# Altium project Smart Dustbin.PrjPcb
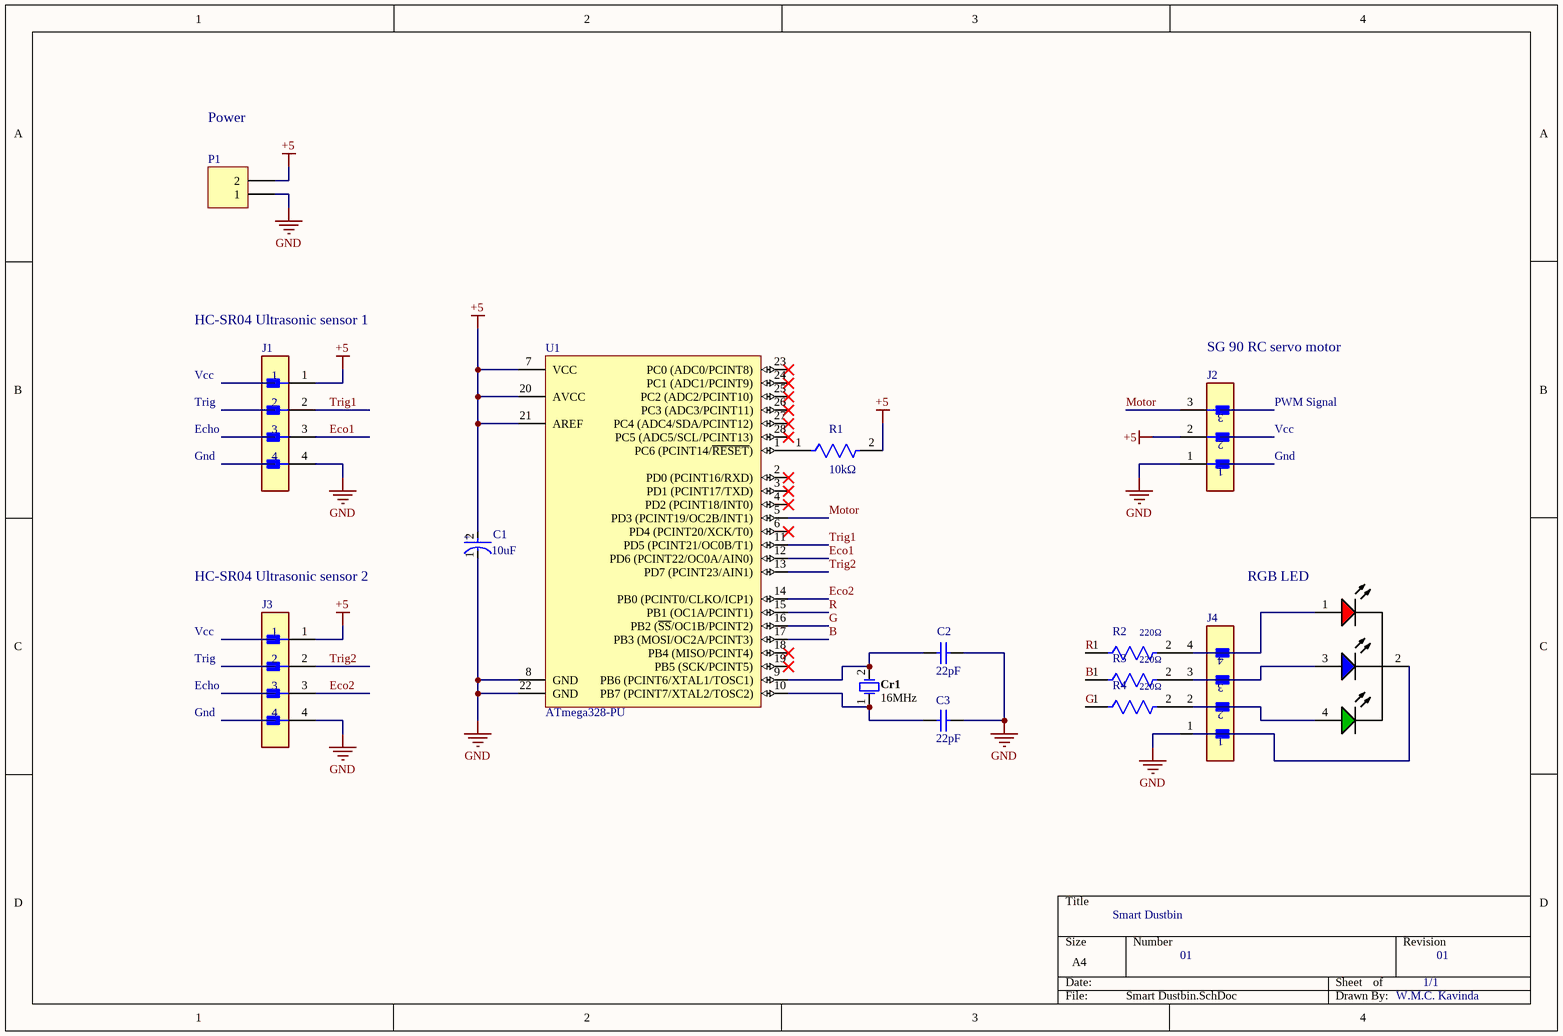
[diagram p0: Smart Dustbin.SchDoc]
1 sheet, 15 parts. Net scope: global (net labels, ports and power ports of the same name join across sheets).
Board file: Smart Dustbin.PcbDoc

## Sheet Smart Dustbin.SchDoc
size A4; SheetNumber: 1; SheetTotal: 1

### Parts
C1  10uF  [FP-RAD-TH-D_8_0_5-L_11_5-MFG]
C2  22pF  [KEMT-C315-THT-2]
C3  22pF  [KEMT-C315-THT-2]
Cr1  16MHz  [FOX-FOXSLF160-20]
DS1  WP154A4SUREQBFZGC  [KING-WP154A4SUREQBFZGC_V]  (value not drawn)
J1  TMM-104-01-S-S  [FP-TMM-104-01-S-S-MFG]  (value not drawn)
J2  TMM-103-03-T-S  [FP-TMM-103-03-T-S-MFG]  (value not drawn)
J3  TMM-104-01-S-S  [FP-TMM-104-01-S-S-MFG]  (value not drawn)
J4  TMM-104-01-S-S  [FP-TMM-104-01-S-S-MFG]  (value not drawn)
P1  Header 2  [HDR1X2]  (value not drawn)
R1  Resistance: 10kΩ  [FP-CF18-MFG]  (hidden comment: 10K)
R2  220Ω  [FP-MBA0204-MFG]
R3  220Ω  [FP-MBA0204-MFG]
R4  220Ω  [FP-MBA0204-MFG]
U1  ATmega328-PU  [28P3]

### Nets
+5: C1.2(A) J1.1 J2.2 J3.1 P1.2 R1.2 U1.7(VCC) U1.20(AVCC) U1.21(AREF)
GND: C1.1(C) C2.2 C3.2 J1.4 J2.1 J3.4 J4.1 P1.1 U1.8(GND) U1.22(GND)
B: R3.1 U1.17(PB3_(MOSI/OC2A/PCINT3))
Eco1: J1.3 U1.12(PD6_(PCINT22/OC0A/AIN0))
Eco2: J3.3 U1.14(PB0_(PCINT0/CLKO/ICP1))
G: R4.1 U1.16(PB2_(~{SS}/OC1B/PCINT2))
Motor: J2.3 U1.5(PD3_(PCINT19/OC2B/INT1))
R: R2.1 U1.15(PB1_(OC1A/PCINT1))
Trig1: J1.2 U1.11(PD5_(PCINT21/OC0B/T1))
Trig2: J3.2 U1.13(PD7_(PCINT23/AIN1))
NetC2_1: C2.1 Cr1.2 U1.9(PB6_(PCINT6/XTAL1/TOSC1))
NetC3_1: C3.1 Cr1.1 U1.10(PB7_(PCINT7/XTAL2/TOSC2))
NetJ4_2: J4.2 R4.2
NetJ4_3: J4.3 R3.2
NetJ4_4: J4.4 R2.2
NetR1_1: R1.1 U1.1(PC6_(PCINT14/~{RESET}))

Not connected (* = marked no-connect by the designer): DS1 1(RED) 2(CATHODE) 3(BLUE) 4(GREEN); U1 2(PD0_(PCINT16/RXD))* 3(PD1_(PCINT17/TXD))* 4(PD2_(PCINT18/INT0))* 6(PD4_(PCINT20/XCK/T0))* 18(PB4_(MISO/PCINT4))* 19(PB5_(SCK/PCINT5))* 23(PC0_(ADC0/PCINT8))* 24(PC1_(ADC1/PCINT9))* 25(PC2_(ADC2/PCINT10))* 26(PC3_(ADC3/PCINT11))* 27(PC4_(ADC4/SDA/PCINT12))* 28(PC5_(ADC5/SCL/PCINT13))*

### Notes on the sheet
- Power
- HC-SR04 Ultrasonic sensor 1
- Vcc
- SG 90 RC servo motor
- Trig
- Echo
- PWM Signal
- Gnd
- HC-SR04 Ultrasonic sensor 2
- RGB LED
- Smart Dustbin
- 01
- 1/1
- W.M.C. Kavinda
- (in symbol CMP-05427-000566-1) +

### Library data of the parts
C1 = CMP-05427-000566-1: Aluminum Electrolytic Capacitors (Radial Lead Type) AEC-Q200 Qualified 10uF ±20% 50V; Impedance: 950mR; Life (Hours): 2000Hour; Ripple Current: 180mA; Lead Diameter: 0.6mm; Package Quantity: 200; Capacitance: 10uF; Max Operating Temperature: 125°C; Diameter: 8mm; Height - Seated (Max): 0.492inch; Construction: RADIAL; Voltage Rating (DC): 50V; RoHS Compliant: Yes; Length: 11.5mm; Voltage Rating: 50V; Series: TA; Termination: Radial; Height: 11.5mm; Mount: Through Hole; Min Operating Temperature: -40°C; Case/Package: Radial; Number of Pins: 2; Tolerance: 20%; REACH SVHC: No SVHC; Packaging: Bulk; Lead Pitch: 3.5mm; ESR (Equivalent Series Resistance): 950mR; Radiation Hardening: No
C2 C3 = CMP-1664-00008-1: Capacitor, Ceramic, 22 pF, +/-10 %, 100 V, -55 to 125 degC, 2-Pin THD, RoHS, Bulk; Max Input Voltage: 40 V; Min Input Voltage: 4.2 V; Output Current: 1.5 A; Output Voltage: 1.2 V; Outputs: 1; Case\Package: TO-220; RoHSCompliant: true; Min Operating Temperature: 0 degC; Max Operating Temperature: 125 degC; Package Quantity: 50; ComponentLink2URL: http://capacitoredge.kemet.com/capedge2/DataSheet/Datasheet-C315C220K1G5TA.pdf?pn=C315C220K1G5TA{BULK}; Radiation Hardening: No; Pins: 3; Length: 10.28 mm; ComponentLink1URL: http://www.kemet.com/; ComponentLink2Description: Datasheet; Height: 9.28 mm; REACH SVHC: No SVHC; ComponentLink1Description: Manufacturer URL; Max Ouput Current: 1.5 A; Weight: 0.08113 oz; Packaging: Rail/Tube; DatasheetVersion: Aug-16; Mount: Through Hole; PackageReference: C315-THT-2; Width: 4.82 mm; PackageDescription: 2-Pin Through Hole Device, Body 3.81 x 2.54 mm
Cr1 = CMP-1749-00003-1: Resistance Weld Thru-Hole Crystal, 16 MHz, -20 to 70 degC, 2-Pin THD, RoHS, Bulk; Voltage Rating: 250 V; Tolerance: 1%; Resistance: 221 kohm; Case\Package: Axial; Power Rating: 250 mW; RoHSCompliant: true; Package Quantity: 200; Packaging: Bulk; Min Operating Temperature: -55 degC; DatasheetVersion: Mar-15; ComponentLink1URL: http://www.foxonline.com/; Max Operating Temperature: 155 degC; PackageReference: FOXSLF160-20; Mount: Through Hole; PackageDescription: 2-Pin Through Hole Device, Body 11.35 x 4.65 mm; ComponentLink1Description: Manufacturer URL; ComponentLink2URL: http://www.foxonline.com/pdfs/hc49slf.pdf; ComponentLink2Description: Datasheet; Length: 0.248 inch
DS1 = CMP-2000-07415-1: Full Color LED Lamp, Dominant Wavelength RGB 630 / 525 / 465 nm, -40 to 85 degC, 4-Pin THD, RoHS; Manufacturer: Kingbright; Viewing Angle: 50°; Wavelength - Dominant: 630nm,525nm,465nm; Online Catalog: 5mm,T-13/4(RGB)RoundwithDomedTopLEDLamp; Millicandela Rating: 1300mcdRed,1700mcdGreen,900mcdBlue; Other Names: 754-1615 / WP154A4SUREQBFZGC-ND; Current - Test: 20mA; Wavelength - Peak: 645nm,515nm,460nm; Color: Red,Green,Blue(RGB); Voltage - Forward (Vf) (Typ): 1.9VRed,3.3VGreen,3.3VBlue; Lens Type: Clear; 3D Model: WP154A4SUREQBFZGW.sldprt / WP154A4SUREQBFZGW.pro / WP154A4SUREQBFZGW.igs / WP154A4SUREQBFZGW.stp; Lens Style/Size: RoundwithDomedTop,5mm,T-13/4; Packaging: Bulk; Datasheet URL: https://www.kingbrightusa.com/images/catalog/spec/WP154A4SUREQBFZGC.pdf; Family: LEDIndication-Discrete; Datasheet Version: Rev. 5A, 08/2014; Category: Optoelectronics; Manufacturer URL: http://www.kingbright.com/; Height: 8.60mm; Mounting Type: ThroughHole; Package Reference: WP154A4SUREQBFZGC; Mounting Technology: ThroughHole; Package Description: 4-Pin Through Hole LED, Dia 5.9 mm, Pitch 1.27 mm; Standard Package: 500; Package / Case: Radial-4Leads
J1 J3 J4 = CMP-02766-001674-1: CONN HEADER VERT 4POS 2MM; Max Current Rating: 3.9A; Connector Type: Male Pin; Max Voltage Rating (AC): 500V; Number of Contacts: 4; Gender: Male; Color: Black; Packaging: Bulk; Orientation: Straight; Contact Mating Length: 0.126inch; Contact Plating: Gold; Max Operating Temperature: 125°C; Housing Color: Black; Contact Material: Bronze; Package Quantity: 1; Housing Material: Polymer; Radiation Hardening: No; Pitch: 2mm; Contact Type: Male Pin; Number of Positions: 4; Number of Rows: 1; Lead Free: Lead Free; Width: 1.97mm; Termination: Solder; Depth: 1.97mm; Series: FleXYZ™ TMM; RoHS Compliant: Yes; Length: 8mm; Min Operating Temperature: -55°C; Mount: Through Hole
J2 = CMP-02766-001695-1: CONN HEADER VERT 3POS 2MM; Gender: Male; Number of Positions: 3; Max Current Rating: 3.9A; Max Voltage Rating (AC): 500V; Packaging: Bulk; RoHS Compliant: Yes; Mount: Through Hole; Length: 6mm; Contact Type: Male Pin; Package Quantity: 1; Depth: 1.97mm; Contact Material: Bronze; Insulation Material: Polymer; Series: TMM; Contact Plating: Tin; Fastening Type: Pull; Housing Color: Black; Pitch: 2mm; Termination: Solder; Contact Mating Length: 0.157inch; Min Operating Temperature: -55°C; REACH SVHC: No SVHC; Orientation: Straight; Number of Rows: 1; Color: Black; Insulation Color: Black; Connector Type: Header; Radiation Hardening: No; Number of Contacts: 3; Lead Free: Lead Free; Contact Finish - Mating: TIN; Max Operating Temperature: 105°C; Housing Material: Polymer; Contact Shape: Square
P1 = Header 2: Header, 2-Pin; LatestRevisionDate: 17-Jul-2002; LatestRevisionNote: Re-released for DXP Platform.; Publisher: Altium Limited
R1 = CMP-26528-000002-1: RES 10K OHM 1/8W 5% CF AXIAL; Manufacturer Part Number: CF18JT10K0; Manufacturer: Stackpole Electronics; Power Rating: 0.125W; Temperature Coefficient: 0-500ppm/°C; Voltage Rating: 250V; Value: 10kΩ; Temperature: -55°C to +155°C; Height: 2mm; Lead Free: Yes; Automotive: No; Device Class L2: Resistors; Package: CF18; Series: CF; ComponentLink2Description: Datasheet; Ipc Land Pattern Name: RESAD656W65L360D200; Temperature Range High: +155°C; RoHS: TRUE; Device Class L3: Through-Hole Resistors; Temperature Range Low: -55°C; Device Class L1: Passive Components; Category: Res; Octopart: https://octopart.com/cf18jt10k0-stackpole+electronics-19205642; Composition: Carbon Film; Digikey Description: RES 10K OHM 1/8W 5% CF AXIAL; ComponentLink2URL: http://www.seielect.com/Catalog/SEI-CF_CFM.pdf; Tolerance: 5%
R2-R4 = CMP-02408-000005-1: RES 220 OHM 0.4W 1% AXIAL; Manufacturer Part Number: MBA02040C2200FC100; Manufacturer: Vishay BC Components; Automotive Grade: Grade 1; Voltage Rating: 200V; Temperature Coefficient: 50ppm/°C; Power Rating: 0.25W; Digikey Description: RES 220 OHM 0.4W 1% AXIAL; Height: 1.6mm; Automotive: Yes; Lead Free: Yes; Value: 220Ω; Mouser Description: Thin Film Resistors - Through Hole .4watt 220ohms 1% 1/8watt body size; Temperature Range Low: -55°C; ComponentLink2Description: Datasheet; Temperature: -55°C to +125°C; Device Class L3: Through-Hole Resistors; Ipc Land Pattern Name: RESAD500W65L360D160; Octopart: https://octopart.com/mba02040c2200fc100-vishay-43743094; Series: MBA/SMA 0204; RoHS: TRUE; Tolerance: 1%; Package: MBA0204; Device Class L1: Passive Components; ComponentLink2URL: http://www.vishay.com/docs/28766/mbxsma.pdf; Category: Res; Composition: Metal Film; Device Class L2: Resistors; Temperature Range High: +125°C; Resistance: 220Ω
U1 = CMP-0095-00015-2: 8-bit AVR Microcontroller, 32KB Flash, 1KB EEPROM, 2KB SRAM, 28-pin PDIP, Industrial Grade (-40°C to 85°C); ComponentLink3Description: ATmega48A/48PA/88A/88PA/168A/168PA/328/328P Summary; RevisionNote: DatasheetVersion updated. URLs added.; DatasheetVersion: revD, May-2011; ComponentLink1URL: http://www.atmel.com/; PackageVersion: revB, Sep-2001; PackageDescription: 28-lead (0.300"/7.62mm Wide) Plastic Dual Inline Package (PDIP); PackageReference: 28P3; ComponentLink1Description: Manufacturer URL; ComponentLink2Description: ATmega48A/48PA/88A/88PA/168A/168PA/328/328P Datasheet; ComponentLink3URL: http://www.atmel.com/dyn/resources/prod_documents/8271S.pdf; ComponentLink2URL: http://www.atmel.com/dyn/resources/prod_documents/8271.pdf